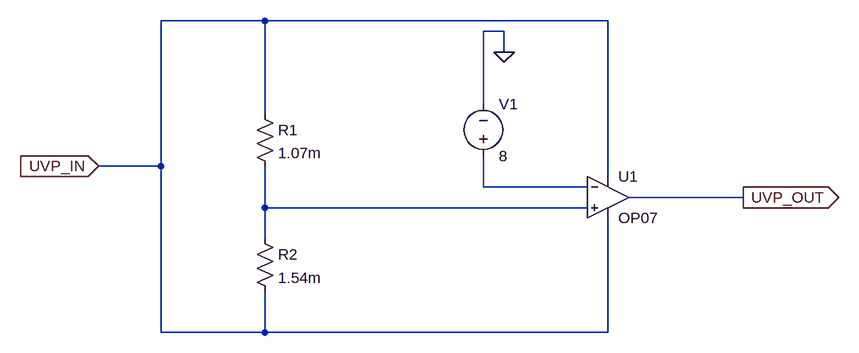
[diagram p0: schematic UVP.asc]
UVP.asc, the LTspice schematic file:
Version 4
SHEET 1 1160 680
WIRE 272 64 112 64
WIRE 800 64 272 64
WIRE 640 80 608 80
WIRE 640 112 640 80
WIRE 608 192 608 80
WIRE 272 208 272 64
WIRE 112 288 112 64
WIRE 112 288 16 288
WIRE 800 304 800 64
WIRE 608 320 608 272
WIRE 768 320 608 320
WIRE 1008 336 832 336
WIRE 272 352 272 288
WIRE 768 352 272 352
WIRE 272 400 272 352
WIRE 112 544 112 288
WIRE 272 544 272 480
WIRE 272 544 112 544
WIRE 800 544 800 368
WIRE 800 544 272 544
FLAG 640 112 0
FLAG 16 288 UVP_IN
IOPIN 16 288 In
FLAG 1008 336 UVP_OUT
IOPIN 1008 336 Out
SYMBOL Res 256 192 R0
SYMATTR InstName R1
SYMATTR Value 1.07m
SYMBOL Res 256 384 R0
SYMATTR InstName R2
SYMATTR Value 1.54m
SYMBOL voltage 608 288 M180
WINDOW 0 24 96 Left 2
WINDOW 3 24 16 Left 2
SYMATTR InstName V1
SYMATTR Value 8
SYMBOL OpAmps/OP07 800 272 R0
SYMATTR InstName U1

The netlist it stands for:
* UVP.asc
R1 UVP_IN N002 1.07m
R2 N002 UVP_IN 1.54m
V1 N001 0 8
XU1 N002 N001 UVP_IN UVP_IN UVP_OUT LT1001  ; OP07, pins In+ In- V+ V- OUT
.lib LTC.lib
.backanno
.end